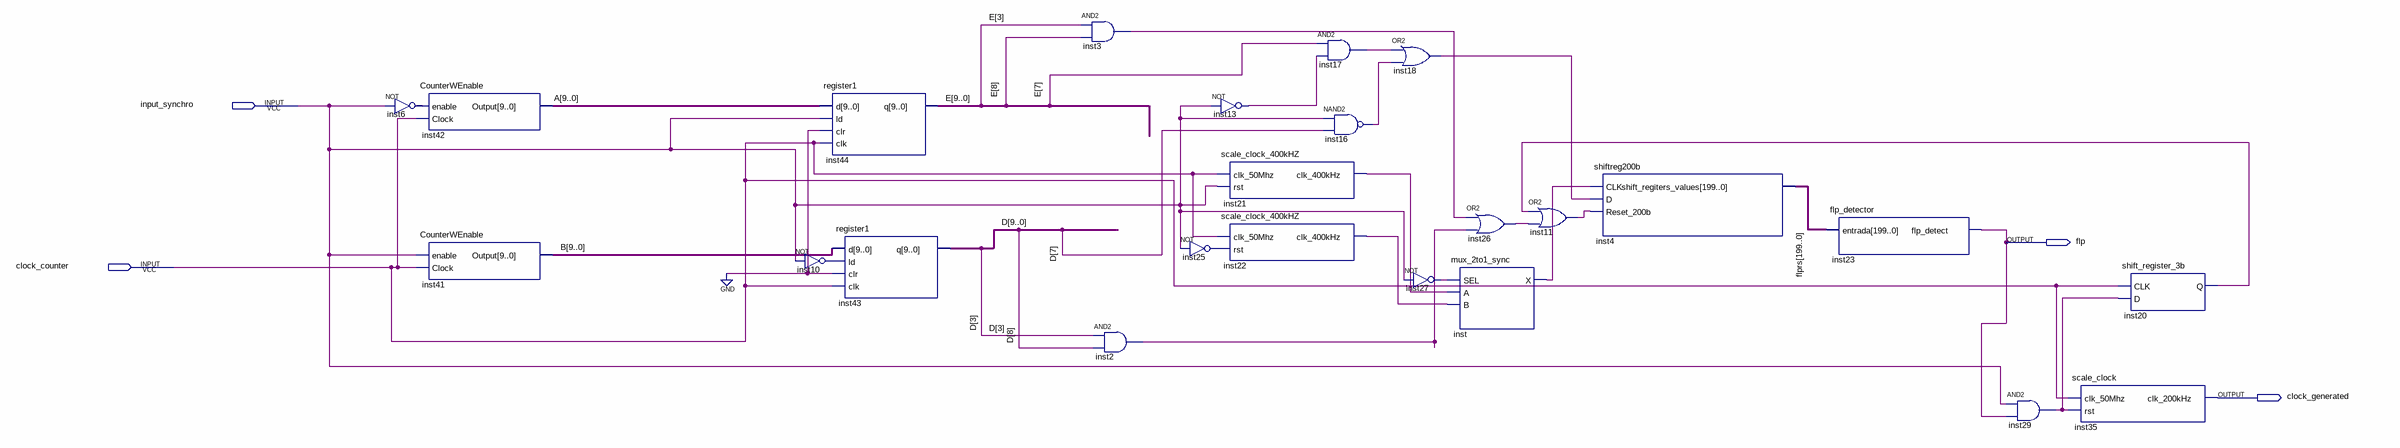
[diagram p0: schematic sheet]
// Quartus schematic synchro.bdf as structural Verilog: 24 symbols, 4 pins
module synchro (
  input  input_synchro,
  input  clock_counter,
  output flp,
  output clock_generated
);

  wire inst2_out, inst3_out, inst6_out, inst10_out, inst11_out, inst13_out, inst16_out, inst17_out,
       inst18_out, inst20_q, inst21_clk_400khz, inst22_clk_400khz, inst25_out, inst26_out, inst27_out,
       inst29_out, inst_x;
  wire [9:0] A, B, D, E;
  wire [199:0] flprs;

  not inst6 (inst6_out, input_synchro);
  CounterWEnable inst42 (.enable(inst6_out), .Clock(clock_counter), .Output(A));
  CounterWEnable inst41 (.enable(input_synchro), .Clock(clock_counter), .Output(B));
  register1 inst44 (.d(A), .ld(input_synchro), .clr(1'b0), .clk(clock_counter), .q(E));
  register1 inst43 (.d(B), .ld(inst10_out), .clr(1'b0), .clk(clock_counter), .q(D));
  not inst10 (inst10_out, input_synchro);
  and inst3 (inst3_out, E[3], E[8]);
  and inst2 (inst2_out, D[3], D[8]);
  not inst25 (inst25_out, input_synchro);
  not inst13 (inst13_out, input_synchro);
  scale_clock_400kHZ inst21 (.clk_50Mhz(clock_counter), .rst(input_synchro), .clk_400kHz(inst21_clk_400khz));
  scale_clock_400kHZ inst22 (.clk_50Mhz(clock_counter), .rst(inst25_out), .clk_400kHz(inst22_clk_400khz));
  and inst17 (inst17_out, E[7], inst13_out);
  nand inst16 (inst16_out, input_synchro, D[7]);
  or inst18 (inst18_out, inst17_out, inst16_out);
  not inst27 (inst27_out, input_synchro);
  or inst26 (inst26_out, inst3_out, inst2_out);
  mux_2to1_sync inst (.SEL(inst27_out), .A(inst21_clk_400khz), .B(inst22_clk_400khz), .X(inst_x));
  or inst11 (inst11_out, inst20_q, inst26_out);
  shiftreg200b inst4 (.CLK(inst_x), .D(inst18_out), .Reset_200b(inst11_out), .shift_regiters_values(flprs));
  flp_detector inst23 (.entrada(flprs), .flp_detect(flp));
  and inst29 (inst29_out, input_synchro, flp);
  scale_clock inst35 (.clk_50Mhz(clock_counter), .rst(inst29_out), .clk_200kHz(clock_generated));
  shift_register_3b inst20 (.CLK(clock_counter), .D(inst29_out), .Q(inst20_q));
endmodule
